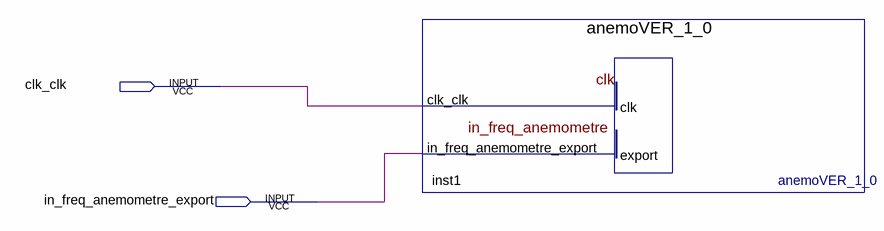
[diagram p0: schematic sheet]
// Quartus schematic bloc_test_avalon_anemo.bdf as structural Verilog: 1 symbols, 2 pins
module bloc_test_avalon_anemo (
  input  clk_clk,
  input  in_freq_anemometre_export
);

  anemoVER_1_0 inst1 (.clk_clk(clk_clk), .in_freq_anemometre_export(in_freq_anemometre_export));
endmodule
